# Altium schematic sheet Processor.SchDoc
size A4; SheetNumber: 4; SheetTotal: 5
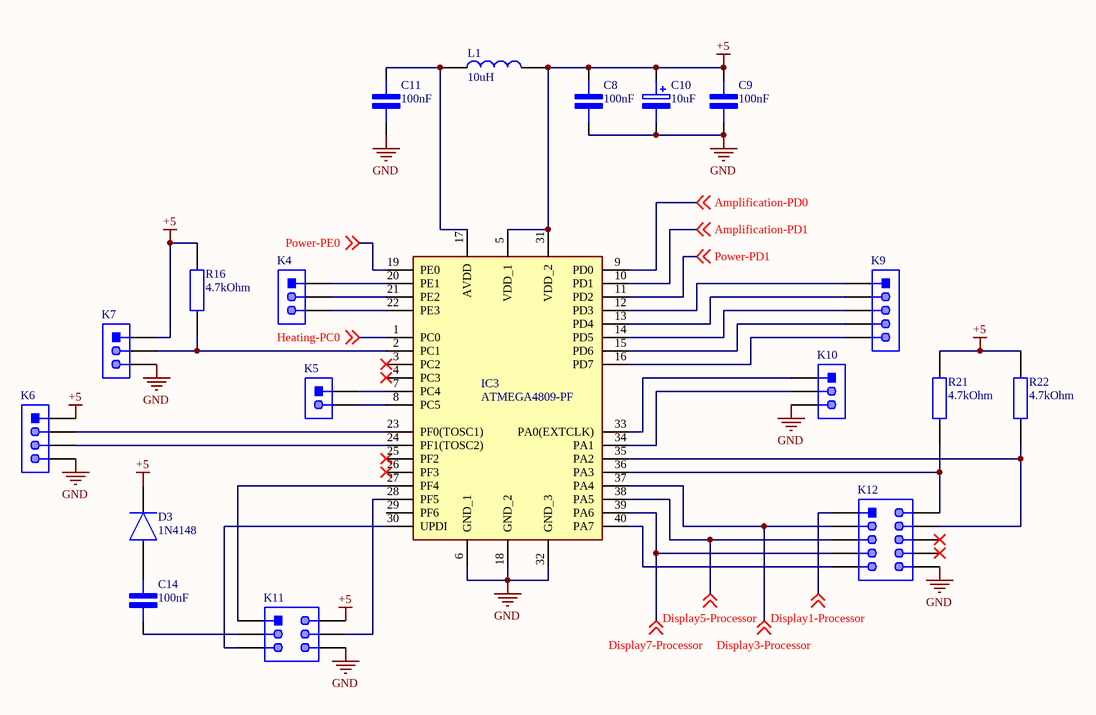
[diagram p0: Processor.SchDoc]

## Parts
C8  100nF  [5mm lead spacing capacitor]
C9  100nF  [5mm lead spacing capacitor]
C10  10uF  [10uF capacitor]
C11  100nF  [5mm lead spacing capacitor]
C14  100nF  [5mm lead spacing capacitor]
D3  1N4148  [0.5mm lead diode]
IC3  ATMEGA4809-PF  [DIP40E]
K4  61300311121  [3-pin header]  (value not drawn)
K5  61300311121  [2-pin header]  (value not drawn)
K6  61300411121  [4-pin header]  (value not drawn)
K7  61300311121  [3-pin header]  (value not drawn)
K9  61300411121  [5-pin header]  (value not drawn)
K10  61300311121  [3-pin header]  (value not drawn)
K11  61301621121  [2-row 6-pin header]  (value not drawn)
K12  61301621121  [10-way boxheader]  (value not drawn)
L1  10uH  [10uH choke coil]
R16  4.7kOhm  [resistor]
R21  4.7kOhm  [resistor]
R22  4.7kOhm  [resistor]

## Nets
+5: C8.2(-) C9.2(-) C10.1(+) D3.1(K) IC3.5(VDD_1) IC3.31(VDD_2) K6.1 K7.1 K11.2 L1.2 R16.2 R21.2 R22.2
GND: C8.1(+) C9.1(+) C10.2(-) C11.1(+) IC3.6(GND_1) IC3.18(GND_2) IC3.32(GND_3) K6.4 K7.3 K10.3 K11.6 K12.10
Amplification-PD0: IC3.9(PD0) ; off-sheet Amplification-PD0
Amplification-PD1: IC3.10(PD1) ; off-sheet Amplification-PD1
Display1-Processor: K12.1 ; off-sheet Display1-Processor
Display3-Processor: IC3.37(PA4) K12.3 ; off-sheet Display3-Processor
Display5-Processor: IC3.38(PA5) K12.5 ; off-sheet Display5-Processor
Display7-Processor: IC3.39(PA6) K12.7 ; off-sheet Display7-Processor
Heating-PC0: IC3.1(PC0) ; off-sheet Heating-PC0
Power-PD1: IC3.11(PD2) ; off-sheet Power-PD1
Power-PE0: IC3.19(PE0) ; off-sheet Power-PE0
NetC11_2: C11.2(-) IC3.17(AVDD) L1.1
NetC14_1: C14.1(+) K11.3
NetC14_2: C14.2(-) D3.2(A)
NetIC3_2: IC3.2(PC1) K7.2 R16.1
NetIC3_7: IC3.7(PC4) K5.1
NetIC3_8: IC3.8(PC5) K5.2
NetIC3_12: IC3.12(PD3) K9.1
NetIC3_13: IC3.13(PD4) K9.2
NetIC3_14: IC3.14(PD5) K9.3
NetIC3_15: IC3.15(PD6) K9.4
NetIC3_16: IC3.16(PD7) K9.5
NetIC3_20: IC3.20(PE1) K4.1
NetIC3_21: IC3.21(PE2) K4.2
NetIC3_22: IC3.22(PE3) K4.3
NetIC3_23: IC3.23(PF0(TOSC1)) K6.2
NetIC3_24: IC3.24(PF1(TOSC2)) K6.3
NetIC3_27: IC3.27(PF4) K11.1
NetIC3_28: IC3.28(PF5) K11.4
NetIC3_30: IC3.30(UPDI) K11.5
NetIC3_33: IC3.33(PA0(EXTCLK)) K10.1
NetIC3_34: IC3.34(PA1) K10.2
NetIC3_35: IC3.35(PA2) K12.4 R22.1
NetIC3_36: IC3.36(PA3) K12.2 R21.1
NetIC3_40: IC3.40(PA7) K12.9

Not connected (* = marked no-connect by the designer): IC3 3(PC2)* 4(PC3)* 25(PF2)* 26(PF3)* 29(PF6); K12 6* 8*

## Library data of the parts
C8 C14 = 100nF: Capacitor; Manufacturer_Name: Nichicon; Manufacturer_Part_Number: UVR1H472MRD; Datasheet Link: https://www.mouser.co.uk/datasheet/2/293/e-vr-6088.pdf; Height: 42mm
C9 C11 = 100nF capacitor: Capacitor; Manufacturer_Name: Nichicon; Manufacturer_Part_Number: UVR1H472MRD; Datasheet Link: https://www.mouser.co.uk/datasheet/2/293/e-vr-6088.pdf; Height: 42mm
C10 = 10uF capacitor: Capacitor Polarised; Manufacturer_Name: Panasonic; Manufacturer_Part_Number: ECA-1HM100B; Datasheet Link: https://componentsearchengine.com//ECA-1HM100B.pdf; Height: 12mm; Mouser2 Part Number: 667-ECA-1HM100B; Mouser2 Price/Stock: https://www.mouser.com/Search/Refine.aspx?Keyword=667-ECA-1HM100B
D3 = 1N4148: Diode; Manufacturer_Name: Nexperia; Datasheet Link: https://datasheet.datasheetarchive.com/originals/distributors/Datasheets-112/DSAP0040891.pdf; Manufacturer_Part_Number: 1N4148
IC3 = ATMEGA4809-PF: Integrated Circuit; Manufacturer_Name: Microchip; Datasheet Link: https://componentsearchengine.com//ATMEGA4809-PF.pdf; Height: 6.35mm; Mouser2 Part Number: 556-ATMEGA4809-PF; Mouser2 Price/Stock: https://www.mouser.com/Search/Refine.aspx?Keyword=556-ATMEGA4809-PF; Manufacturer_Part_Number: ATMEGA4809-PF
K4 K7 K10 = 3-pin header: THT Vertical Pin Header WR-PHD, Pitch 2.54 mm, Single Row, 3 pins; Manufacturer: Wurth Elektronik; Withstanding Voltage: 500VAC; Working Voltage: 250VAC; Rated Current: 3A; Pitch: 2.54mm; Pin Number: 3; Gender: Male; Contact Resistance: 20mOhm; Package Reference: 61300311121; Manufacturer URL: http://www.we-online.de; Datasheet URL: https://katalog.we-online.de/em/datasheet/6130xx11121.pdf; Operating Temperature: -40to105degC; Part Number: 61300311121; Orientation: Vertical; Packaging: Bag; Row Number: Single; Mounting Technology: THT; Publisher: WurthElektronik
K5 = 2-pin header: THT Vertical Pin Header WR-PHD, Pitch 2.54 mm, Single Row, 3 pins; Manufacturer: Wurth Elektronik; Withstanding Voltage: 500VAC; Working Voltage: 250VAC; Rated Current: 3A; Pitch: 2.54mm; Pin Number: 3; Gender: Male; Contact Resistance: 20mOhm; Package Reference: 61300311121; Manufacturer URL: http://www.we-online.de; Datasheet URL: https://katalog.we-online.de/em/datasheet/6130xx11121.pdf; Operating Temperature: -40to105degC; Part Number: 61300311121; Orientation: Vertical; Packaging: Bag; Row Number: Single; Mounting Technology: THT; Publisher: WurthElektronik
K6 = 4-pin header: THT Vertical Pin Header WR-PHD, Pitch 2.54 mm, Single Row, 4 pins; Manufacturer: Wurth Elektronik; Withstanding Voltage: 500VAC; Rated Current: 3A; Working Voltage: 250VAC; Pin Number: 4; Gender: Male; Contact Resistance: 20mOhm; Pitch: 2.54mm; Manufacturer URL: http://www.we-online.de; Operating Temperature: -40to105degC; Packaging: Bag; Mounting Technology: THT; Package Reference: 61300411121; Datasheet URL: https://katalog.we-online.de/em/datasheet/6130xx11121.pdf; Publisher: WurthElektronik; Part Number: 61300411121; Row Number: Single; Orientation: Vertical
K9 = 5-pin header: THT Vertical Pin Header WR-PHD, Pitch 2.54 mm, Single Row, 4 pins; Manufacturer: Wurth Elektronik; Withstanding Voltage: 500VAC; Rated Current: 3A; Working Voltage: 250VAC; Pin Number: 4; Gender: Male; Contact Resistance: 20mOhm; Pitch: 2.54mm; Manufacturer URL: http://www.we-online.de; Operating Temperature: -40to105degC; Packaging: Bag; Mounting Technology: THT; Package Reference: 61300411121; Datasheet URL: https://katalog.we-online.de/em/datasheet/6130xx11121.pdf; Publisher: WurthElektronik; Part Number: 61300411121; Row Number: Single; Orientation: Vertical
K11 = 6-pin header: THT Vertical Pin Header WR-PHD, Pitch 2.54 mm, Dual Row, 16 pins; Manufacturer: Wurth Elektronik; Gender: Male; Rated Current: 3A; Pitch: 2.54mm; Withstanding Voltage: 500VAC; Contact Resistance: 20mOhm; Working Voltage: 250VAC; Pin Number: 16; Mounting Technology: THT; Orientation: Vertical; Manufacturer URL: http://www.we-online.de; Row Number: Dual; Part Number: 61301621121; Datasheet URL: https://katalog.we-online.de/em/datasheet/6130xx21121.pdf; Packaging: Bag; Operating Temperature: -40to105degC; Publisher: WurthElektronik; Package Reference: 61301621121
K12 = 10-pole box header: THT Vertical Pin Header WR-PHD, Pitch 2.54 mm, Dual Row, 16 pins; Manufacturer: Wurth Elektronik; Gender: Male; Rated Current: 3A; Pitch: 2.54mm; Withstanding Voltage: 500VAC; Contact Resistance: 20mOhm; Working Voltage: 250VAC; Pin Number: 16; Mounting Technology: THT; Orientation: Vertical; Manufacturer URL: http://www.we-online.de; Row Number: Dual; Part Number: 61301621121; Datasheet URL: https://katalog.we-online.de/em/datasheet/6130xx21121.pdf; Packaging: Bag; Operating Temperature: -40to105degC; Publisher: WurthElektronik; Package Reference: 61301621121
L1 = 10uH choke coil: Inductor; Manufacturer_Name: Bourns; Manufacturer_Part_Number: 78F100J-RC; Datasheet Link: https://componentsearchengine.com//78F100J-RC.pdf; Mouser2 Part Number: 542-78F100-RC; Mouser2 Price/Stock: https://www.mouser.com/Search/Refine.aspx?Keyword=542-78F100-RC
R16 R21 R22 = 4.7kOhm: Resistor; Manufacturer_Name: YAGEO (PHYCOMP); Manufacturer_Part_Number: CFR-25JT-52-4K7; Datasheet Link: https://componentsearchengine.com//CFR-25JT-52-4K7.pdf; Mouser2 Part Number: 603-CFR-25JT-52-4K7; Mouser2 Price/Stock: https://www.mouser.com/Search/Refine.aspx?Keyword=603-CFR-25JT-52-4K7